# EAGLE design pcb_max30102 (EAGLE 9.6.2)
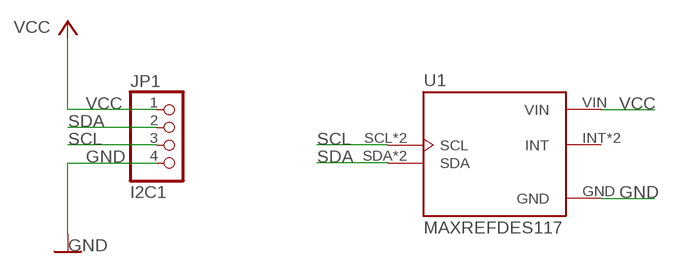
[diagram p0: schematic, sheet 1]

## Parts
JP1  I2C1  PINHD-1X4/90  [1X04/90]
U1  MAXREFDES117  [MODULE_MAXREFDES117]

## Nets
GND: JP1.4 U1.GND
SCL: JP1.3 U1.SCL U1.SCL1(SCL)
SDA: JP1.2 U1.SDA U1.SDA1(SDA)
VCC: JP1.1 U1.VIN
Unconnected: U1.INT U1.INT1(INT)

## Library data of the parts
JP1 = pinhead:PINHD-1X4: PIN HEADER
U1 = MAXREFDES117:MAXREFDES117: MAX1921, MAX14595, MAX30102 - Medical, Pulse Oximeter (PO or SpO2) Sensor Evaluation Board Check availability <https://pricing.snapeda.com/parts/MAXREFDES117/Maxim%20Integrated%20Products/view-part?ref=eda>; AVAILABILITY: In Stock; DESCRIPTION: System Board, Heart-Rate And Pulse-Oximetry Monitor; MF: Maxim Integrated Products; MP: MAXREFDES117; PACKAGE: None; PRICE: None; PURCHASE-URL: https://pricing.snapeda.com/search/part/MAXREFDES117/?ref=eda

## Net classes
0 default: width 0.7 mm, drill 0.6 mm, clearance 0.3 mm

## Board
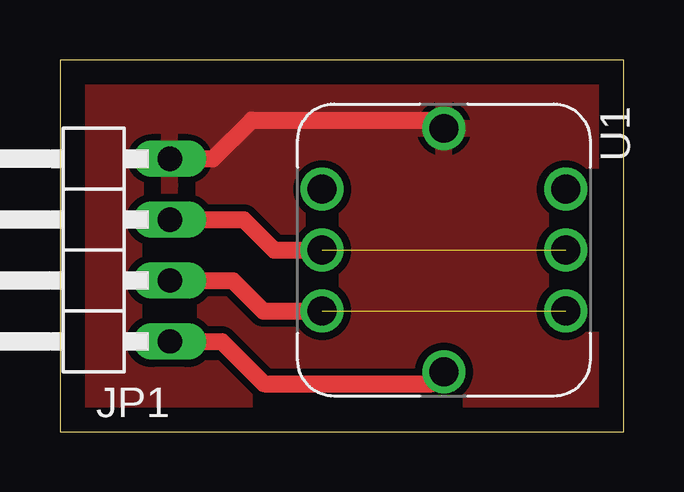
[diagram p1: board, top side]

Size 23.5 x 15.5 mm. Coordinates in mm from the lower left corner, seen from the top.
Outline: 0,0 23.5,0 23.5,15.5 0,15.5 0,0
Copper layers (1*16): Top 0.035mm / dielectric 1.5mm / Bottom 0.035mm
Design rules "default": minimum track width 6mil, minimum drill 0.35mm, track to track 6mil, track to pad 6mil, pad to pad 6mil, via to via 6mil, smd to smd 6mil, copper to edge 40mil, drill to drill 6mil, minimum pad ring 10mil, minimum via ring 8mil, stop-mask expansion 4mil, vias tented up to drill 0mil, thermal gap 10mil

### Footprints (pad centres in the part's own frame; a part is rotated, then mirrored left to right if it is on the bottom)
1X04/90 = drill 1.016 long: 1 -3.81,-3.81; 2 -1.27,-3.81; 3 1.27,-3.81; 4 3.81,-3.81
MODULE_MAXREFDES117 = drill 1.2: GND -5.08,0; INT -2.54,5.08; INT1 -2.54,-5.08; SCL 0,5.08; SCL1 0,-5.08; SDA 2.54,5.08; SDA1 2.54,-5.08; VIN 5.08,0

### Placement (x,y rotation side)
JP1  0.77,7.57 90 top
U1  16.01,7.57 270 top

### Tracks (layer width: path | path; a pad name or v marks a point on that pad's centre or on a via)
GND
  Top 0.7: JP1.4 6.38,11.38 8,13 15.66,13 U1.GND
  pour Top: 0,15.5 23.5,15.5 23.5,0 0,0
SCL  (1 unrouted)
  Top 0.7: JP1.3 7.66,8.84 8.93,7.57 U1.SCL1
SDA  (1 unrouted)
  Top 0.7: JP1.2 7.2,6.3 8.47,5.03 U1.SDA1
VCC
  Top 0.7: JP1.1 6.74,3.76 8.5,2 15.52,2 U1.VIN